# Altium schematic sheet USB_HUB1 DN PORT 5.SchDoc: USB_HUB 3.0
size A3; DrawnBy: Luca Schenetti; Engineer: Luca Schenetti; Revision: A; SheetNumber: 10; SheetTotal: 10
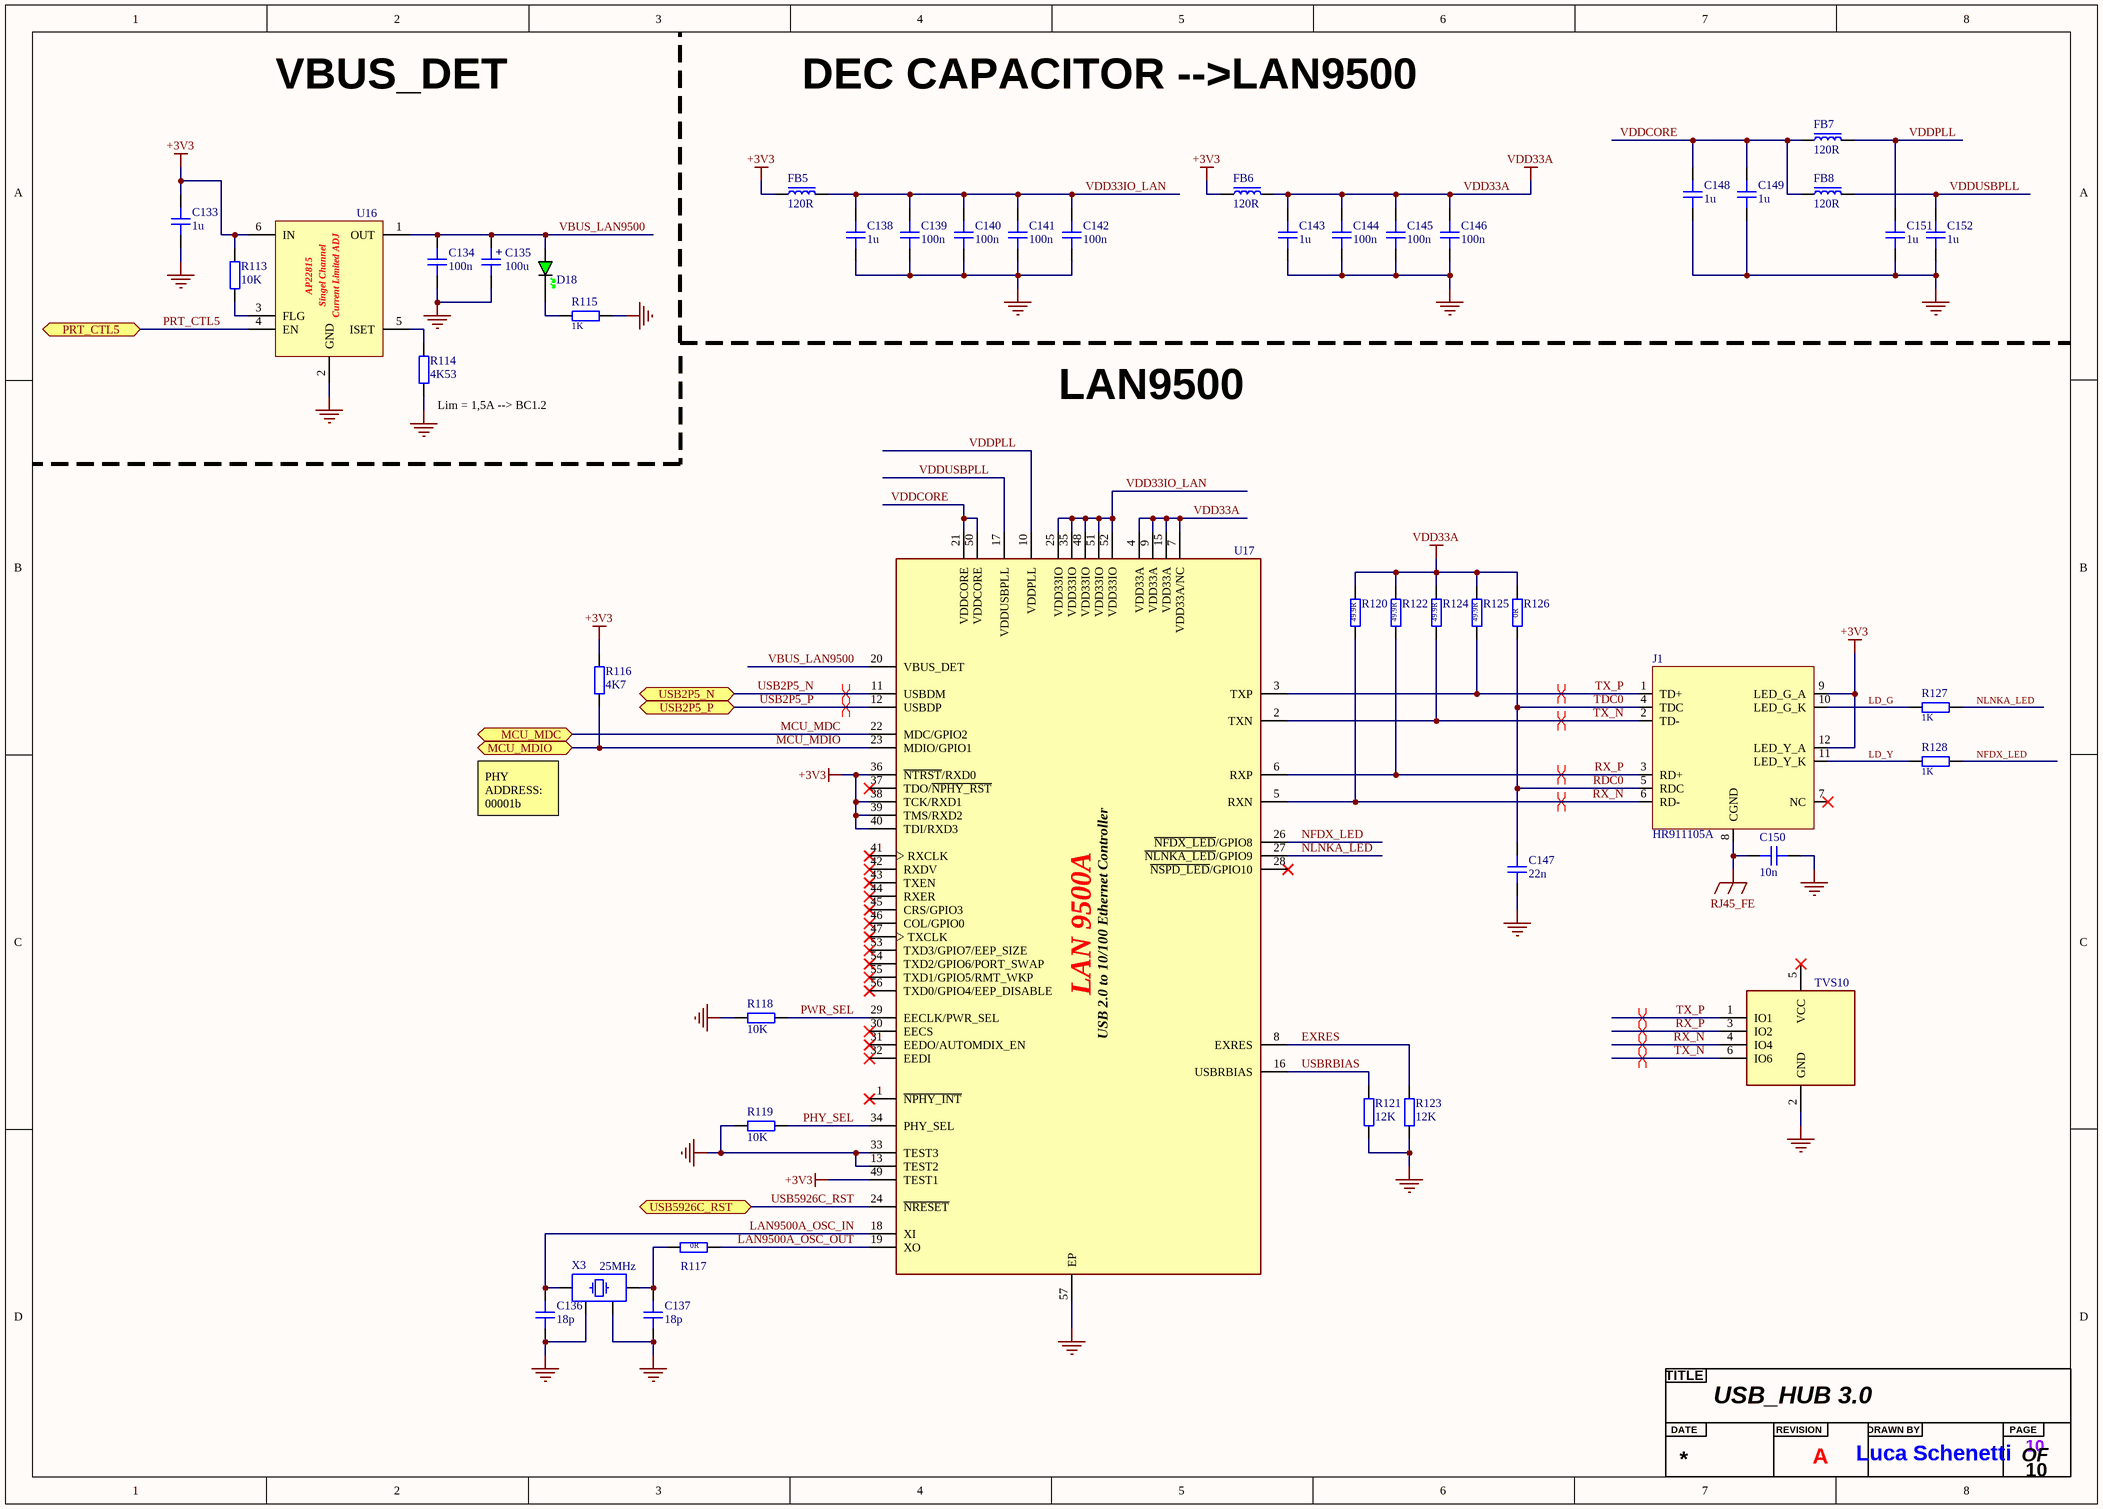
[diagram p0: USB_HUB1 DN PORT 5.SchDoc]

## Parts
?  Title  (value not drawn)  (graphical)
C133  1u  [CAP_0603]
C134  100n  [CAP_0603]
C135  100u  [CAP_AE_SMD_D6MM3_H5M55]
C136  18p  [CAP_0402]
C137  18p  [CAP_0402]
C138  1u  [CAP_0603]
C139  100n  [CAP_0603]
C140  100n  [CAP_0603]
C141  100n  [CAP_0603]
C142  100n  [CAP_0603]
C143  1u  [CAP_0603]
C144  100n  [CAP_0603]
C145  100n  [CAP_0603]
C146  100n  [CAP_0603]
C147  22n  [CAP_0603]
C148  1u  [CAP_0603]
C149  1u  [CAP_0603]
C150  10n  [CAP_1206]
C151  1u  [CAP_0603]
C152  1u  [CAP_0603]
D18  GREEN  [LED_0603_GREEN]  (value not drawn)
FB5  120R  [FB_0603]
FB6  120R  [FB_0603]
FB7  120R  [FB_0603]
FB8  120R  [FB_0603]
J1  HR911105A  [HR911105A]
R113  10K  [RES_0603]
R114  4K53  [RES_0603]
R115  1K  [RES_0603]
R116  4K7  [RES_0603]
R117  0R  [RES_0402]
R118  10K  [RES_0603]
R119  10K  [RES_0603]
R120  49.9R  [RES_0402]
R121  12K  [RES_0603]
R122  49.9R  [RES_0402]
R123  12K  [RES_0603]
R124  49.9R  [RES_0402]
R125  49.9R  [RES_0402]
R126  0R  [RES_0402]
R127  1K  [RES_0603]
R128  1K  [RES_0603]
TVS10  ESD 5A 75W 12.5V 6V Bidirectional 5V  [SRV05-4]  (value not drawn)
U16  Single-Channel, Current-Limited,ISET  [AP22615AWU-7]  (value not drawn)
U17  USB 2.0 to 10/100 Ethernet  [LAN9500A-ABZJ-TR]  (value not drawn)
X3  25MHz  [XTAL_3225]

## Ports
MCU_MDC (bidir, see MCU[4C]), MCU_MDIO (bidir, see MCU[4C]), PRT_CTL5 (bidir, see USB_HUB1[6D]), USB2P5_N (bidir, see USB_HUB1[6D]), USB2P5_P (bidir, see USB_HUB1[6D]), USB5926C_RST (bidir, see MCU[8C], USB_HUB1 DN PORT 1_2[5B], USB_HUB1 DN PORT 1_2[5D], USB_HUB1 DN PORT 6[1C], USB_HUB1 UP PORT0[5C], USB_HUB1[3C])

## Nets
+3V3: C133.2 FB5.1 FB6.1 J1.9(LED_G_A) J1.12(LED_Y_A) R113.2 R116.2 U16.6(IN) U17.36(~{NTRST}/RXD0) U17.38(TCK/RXD1) U17.39(TMS/RXD2) U17.40(TDI/RXD3) U17.49(TEST1)
GND: C133.1 C134.1 C135.2 C136.1 C137.1 C138.1 C139.1 C140.1 C141.1 C142.1 C143.1 C144.1 C145.1 C146.1 C147.1 C148.1 C149.1 C150.2 C151.1 C152.1 R114.1 R115.2 R118.2 R119.2 R121.1 R123.1 TVS10.2(GND) U16.2(GND) U17.13(TEST2) U17.33(TEST3) U17.57(EP) X3.2 X3.4
RJ45_FE: C150.1 J1.8(CGND)
VDD33A: C143.2 C144.2 C145.2 C146.2 FB6.2 R120.2 R122.2 R124.2 R125.2 R126.2 U17.4(VDD33A) U17.7(VDD33A/NC) U17.9(VDD33A) U17.15(VDD33A)
EXRES: R123.2 U17.8(EXRES)
LAN9500A_OSC_IN: C136.2 U17.18(XI) X3.3
LAN9500A_OSC_OUT: R117.2 U17.19(XO)
LD_G: J1.10(LED_G_K) R127.1
LD_Y: J1.11(LED_Y_K) R128.1
MCU_MDC: U17.22(MDC/GPIO2) ; port MCU_MDC
MCU_MDIO: R116.1 U17.23(MDIO/GPIO1) ; port MCU_MDIO
NFDX_LED: R128.2 U17.26(~{NFDX_LED}/GPIO8)
NLNKA_LED: R127.2 U17.27(~{NLNKA_LED}/GPIO9)
PHY_SEL: R119.1 U17.34(PHY_SEL)
PRT_CTL5: U16.4(EN) ; port PRT_CTL5
PWR_SEL: R118.1 U17.29(EECLK/PWR_SEL)
RDC0: C147.2 J1.4(TDC) J1.5(RDC) R126.1  [also labelled TDC0]
RX_N: J1.6(RD-) R120.1 TVS10.4(IO4) U17.5(RXN)
RX_P: J1.3(RD+) R122.1 TVS10.3(IO2) U17.6(RXP)
TX_N: J1.2(TD-) R124.1 TVS10.6(IO6) U17.2(TXN)
TX_P: J1.1(TD+) R125.1 TVS10.1(IO1) U17.3(TXP)
USB2P5_N: U17.11(USBDM) ; port USB2P5_N
USB2P5_P: U17.12(USBDP) ; port USB2P5_P
USB5926C_RST: U17.24(~{NRESET}) ; port USB5926C_RST
USBRBIAS: R121.2 U17.16(USBRBIAS)
VBUS_LAN9500: C134.2 C135.1 D18.A U16.1(OUT) U17.20(VBUS_DET)
VDD33IO_LAN: C138.2 C139.2 C140.2 C141.2 C142.2 FB5.2 U17.25(VDD33IO) U17.35(VDD33IO) U17.48(VDD33IO) U17.51(VDD33IO) U17.52(VDD33IO)
VDDCORE: C148.2 C149.2 FB7.1 FB8.1 U17.21(VDDCORE) U17.50(VDDCORE)
VDDPLL: C151.2 FB7.2 U17.10(VDDPLL)
VDDUSBPLL: C152.2 FB8.2 U17.17(VDDUSBPLL)
NetC137_2: C137.2 R117.1 X3.1
NetD18_K: D18.K R115.1
NetR113_1: R113.1 U16.3(FLG)
NetR114_2: R114.2 U16.5(ISET)

Not connected (* = marked no-connect by the designer): J1 7(NC)*; TVS10 5(VCC)*; U17 1(~{NPHY_INT})* 28(~{NSPD_LED}/GPIO10)* 30(EECS)* 31(EEDO/AUTOMDIX_EN)* 32(EEDI)* 37(TDO/~{NPHY_RST})* 41(RXCLK)* 42(RXDV)* 43(TXEN)* 44(RXER)* 45(CRS/GPIO3)* 46(COL/GPIO0)* 47(TXCLK)* 53(TXD3/GPIO7/EEP_SIZE)* 54(TXD2/GPIO6/PORT_SWAP)* 55(TXD1/GPIO5/RMT_WKP)* 56(TXD0/GPIO4/EEP_DISABLE)*

## Layout directives
differential pair; differential pair class DIFF_MDI_100Ω: RX_N, RX_P, TX_N, TX_P
differential pair; differential pair class DIFF_USB_90Ω: USB2P5_N, USB2P5_P

## Notes on the sheet
- VBUS_DET
- DEC CAPACITOR -->LAN9500
- (near R114) Lim = 1,5A --> BC1.2
- LAN9500
- PHY ADDRESS: 00001b
- (in symbol AP22615AWU-7) AP22815; Singel Channel; Current Limited ADJ
- (in symbol CAP_ALEL_6.3x5.5) +
- (in symbol LAN9500A-ABZJ-TR) LAN 9500A; USB 2.0 to 10/100 Ethernet Controller
- (in symbol Title) TITLE; DATE; REVISION; DRAWN BY; PAGE; OF

## Library data of the parts
C133 C138 C143 C148 C149 C151 C152 = CAP_0603: Capacitor SMD 0603 [C15849]; Manufacturer: *; Manufacturer Part Number: *; Distributor Link: *; LCSC: *; Rating: *; Dielectric: *
C134 C139-C142 C144-C146 = CAP_0603: Capacitor SMD 0603 [C14663]; Manufacturer: *; Manufacturer Part Number: *; Distributor Link: *; LCSC: *; Rating: *; Dielectric: *
C135 = CAP_ALEL_6.3x5.5: [C59936]; Manufacturer: *; Manufacturer Part Number: *; Distributor Link: *; LCSC: *
C136 C137 = CAP_0402: Capacitor SMD 0402 [C1549]; Manufacturer: *; Manufacturer Part Number: *; Distributor Link: *; LCSC: *; Rating: *; Dielectric: *
C147 = CAP_0603: Capacitor SMD 0603 [C21122]; Manufacturer: *; Manufacturer Part Number: *; Distributor Link: *; LCSC: *; Rating: *; Dielectric: *
C150 = CAP_1206: [C1846]; Manufacturer: *; Manufacturer Part Number: *; Distributor Link: *; LCSC: *; Rating: *; Dielectric: *
D18 = LED_0603_GREEN: [C2986059]
FB5-FB8 = FB_0603: Ferrite Bead SMD 0603[C76892]; Manufacturer: *; Manufacturer Part Number: *; Distributor Link: *; LCSC: *
J1 = HR911105A: Single Port RJ45 Connector w/ Integrated Magnetic and LED 10/100 Base-T [C12074]; Manufacturer: HanRun; Manufacturer Part Number: HR911105A
R113 R118 R119 = RES_0603: [C25804]; Manufacturer: *; Manufacturer Part Number: *; Distributor Link: *; LCSC: *
R114 = RES_0603: [C25971]; Manufacturer: *; Manufacturer Part Number: *; Distributor Link: *; LCSC: *
R115 R127 R128 = RES_0603: [C21190]; Manufacturer: *; Manufacturer Part Number: *; Distributor Link: *; LCSC: *
R116 = RES_0603: [C23162]; Manufacturer: *; Manufacturer Part Number: *; Distributor Link: *; LCSC: *
R117 = RES_0402: Resistor SMD 0402 [C17168]; Manufacturer: *; Manufacturer Part Number: *; Distributor Link: *; LCSC: *
R120 R122 R124 R125 = RES_0402: [C25120]; Manufacturer: *; Manufacturer Part Number: *; Distributor Link: *; LCSC: *
R121 R123 = RES_0603: [C22790]; Manufacturer: *; Manufacturer Part Number: *; Distributor Link: *; LCSC: *
R126 = RES_0402: [C17168]; Manufacturer: *; Manufacturer Part Number: *; Distributor Link: *; LCSC: *
TVS10 = SRV05-4: [C7420376]
U16 = AP22615AWU-7: [C2680357]
U17 = LAN9500A-ABZJ-TR: [C2651877]
X3 = TSX-3225_24.0000MF15X-AC: Crystal SMD 24MHz 10PPM 7pF 3225 [C9006]; Manufacturer: Epson; Manufacturer Part Number: TSX-3225 24.0000MF15X-AC